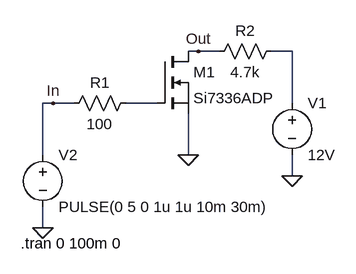
[diagram p0: schematic MOSFET Switch.asc]
MOSFET Switch.asc, the LTspice schematic file:
Version 4
SHEET 1 880 680
WIRE 192 -16 176 -16
WIRE 224 -16 192 -16
WIRE 336 -16 304 -16
WIRE -32 64 -48 64
WIRE 0 64 -32 64
WIRE 128 64 80 64
WIRE 336 64 336 -16
WIRE -48 144 -48 64
WIRE 176 144 176 80
WIRE 336 176 336 144
WIRE -48 256 -48 224
FLAG -48 256 0
FLAG 336 176 0
FLAG 176 144 0
FLAG -32 64 In
FLAG 192 -16 Out
SYMBOL nmos 128 -16 R0
SYMATTR InstName M1
SYMATTR Value Si7336ADP
SYMBOL voltage 336 48 R0
WINDOW 123 0 0 Left 0
WINDOW 39 0 0 Left 0
SYMATTR InstName V1
SYMATTR Value 12V
SYMBOL res 96 48 R90
WINDOW 0 0 56 VBottom 2
WINDOW 3 32 56 VTop 2
SYMATTR InstName R1
SYMATTR Value 100
SYMBOL res 320 -32 R90
WINDOW 0 0 56 VBottom 2
WINDOW 3 32 56 VTop 2
SYMATTR InstName R2
SYMATTR Value 4.7k
SYMBOL voltage -48 128 R0
WINDOW 123 0 0 Left 0
WINDOW 39 0 0 Left 0
SYMATTR InstName V2
SYMATTR Value PULSE(0 5 0 1u 1u 10m 30m)
TEXT -82 280 Left 2 !.tran 0 100m 0

The netlist it stands for:
* MOSFET Switch.asc
M1 Out N002 0 0 Si7336ADP
V1 N001 0 12V
R1 N002 In 100
R2 N001 Out 4.7k
V2 In 0 PULSE(0 5 0 1u 1u 10m 30m)
.model NMOS NMOS
.model PMOS PMOS
.lib standard.mos
.tran 0 100m 0
.backanno
.end